# EAGLE design RN2483_2903_1ANT_RevA (EAGLE 7.2.0)
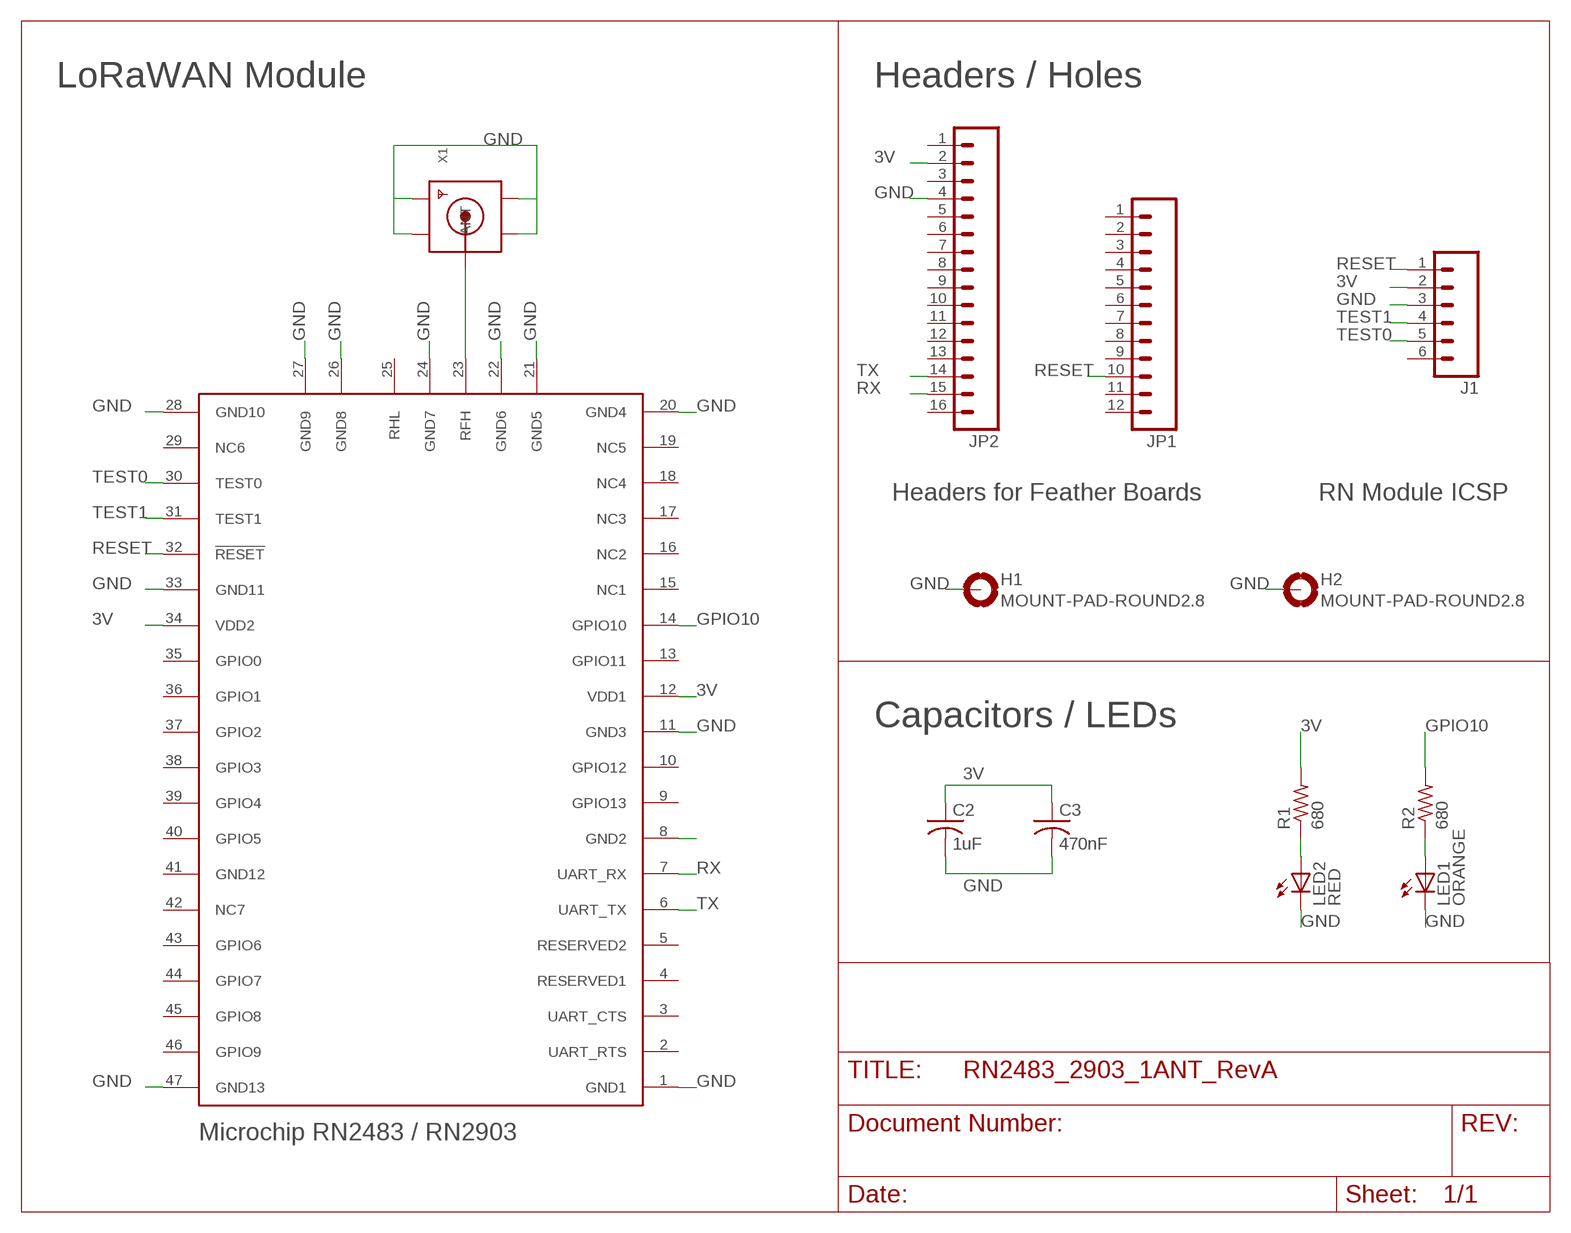
[diagram p0: schematic, sheet 1]

## Parts
C2  1uF  C-USC0603  [C0603]
C3  470nF  C-USC0603  [C0603]
H1  MOUNT-PAD-ROUND2.8  [2,8-PAD]
H2  MOUNT-PAD-ROUND2.8  [2,8-PAD]
J1  M06SILK_FEMALE_PTH  [1X06]
JP1  M12NO_SILK  [1X12_NO_SILK]
JP2  M161X16_NO_SILK  [1X16_NO_SILK]
LED1  ORANGE  LEDCHIPLED_0805  [CHIPLED_0805]
LED2  RED  LEDCHIPLED_0805  [CHIPLED_0805]
R1  680  R-US_R0603  [R0603]
R2  680  R-US_R0603  [R0603]
U$2  RN2483/2903  [RN2483/2903]
X1  SMACONNECTOR_EDGE  [SMA_EDGELAUNCH]

## Nets
3V: C2.1 C3.1 J1.2 JP2.2 R1.2 U$2.12(VDD1) U$2.34(VDD2)
GND: C2.2 C3.2 H1.B2,8(MOUNT) H2.B2,8(MOUNT) J1.3 JP2.4 LED1.C LED2.C U$2.1(GND1) U$2.11(GND3) U$2.20(GND4) U$2.21(GND5) U$2.22(GND6) U$2.24(GND7) U$2.26(GND8) U$2.27(GND9) U$2.28(GND10) U$2.33(GND11) U$2.47(GND13) X1.GND@1(GND4) X1.GND@2(GND3) X1.GND@3(GND2) X1.GND@4(GND1)
GPIO10: R2.2 U$2.14(GPIO10)
N$2: LED1.A R2.1
N$3: U$2.23(RFH) X1.P(ANT)
N$5: U$2.8(GND2)
N$9: LED2.A R1.1
RESET: J1.1 JP1.10 U$2.32(!RESET)
RX: JP2.15 U$2.7(UART_RX)
TEST0: J1.5 U$2.30(TEST0)
TEST1: J1.4 U$2.31(TEST1)
TX: JP2.14 U$2.6(UART_TX)
Unconnected: J1.6 JP1.1 JP1.2 JP1.3 JP1.4 JP1.5 JP1.6 JP1.7 JP1.8 JP1.9 JP1.11 JP1.12 JP2.1 JP2.3 JP2.5 JP2.6 JP2.7 JP2.8 JP2.9 JP2.10 JP2.11 JP2.12 JP2.13 JP2.16 U$2.2(UART_RTS) U$2.3(UART_CTS) U$2.4(RESERVED1) U$2.5(RESERVED2) U$2.9(GPIO13) U$2.10(GPIO12) U$2.13(GPIO11) U$2.15(NC1) U$2.16(NC2) U$2.17(NC3) U$2.18(NC4) U$2.19(NC5) U$2.25(RHL) U$2.29(NC6) U$2.35(GPIO0) U$2.36(GPIO1) U$2.37(GPIO2) U$2.38(GPIO3) U$2.39(GPIO4) U$2.40(GPIO5) U$2.41(GND12) U$2.42(NC7) U$2.43(GPIO6) U$2.44(GPIO7) U$2.45(GPIO8) U$2.46(GPIO9)

## Notes on the sheet
- LoRaWAN Module | Headers / Holes
- Headers for Feather Boards | RN Module ICSP
- Capacitors / LEDs
- Microchip RN2483 / RN2903

## Library data of the parts
C2 C3 = adafruit:C-US: CAPACITOR, American symbol
H1 H2 = holes:MOUNT-PAD-ROUND: MOUNTING PAD, round
J1 = SparkFun-ConnectorsNEW:M06: Header 6 Standard 6-pin 0.1" header. Use with straight break away headers (SKU : PRT-00116), right angle break away headers (PRT-00553), swiss pins (PRT-00743), machine pins (PRT-00117), and female headers (PRT-00115). Molex polarized connector foot print use with SKU : PRT-08094 with associated crimp pins and housings. NOTES ON THE VARIANTS LOCK and LOCK_LONGPADS... This footprint was designed to help hold the alignment of a through-hole component (i.e. 6-pin header) while soldering it into place. You may notice that each hole has been shifted either up or down by 0.005 of an inch from it's more standard position (which is a perfectly straight line). This slight alteration caused the pins (the squares in the middle) to touch the edges of the holes. Because they are alternating, it causes a "brace" to hold the component in place. 0.005 has proven to be the perfect amount of "off-center" position when using our standard breakaway headers. Although looks a little odd when you look at the bare footprint, once you have a header in there, the alteration is very hard to notice. Also,if you push a header all the way into place, it is covered up entirely on the bottom side. This idea of altering the position of holes to aid alignment will be further integrated into the Sparkfun Library for other footprints. It can help hold any component with 3 or more connection pins.; PROD_ID: CONN-08437
JP1 = SparkFun-Connectors:M12: Header 12 Standard 12-pin 0.1" header. Use with straight break away headers (SKU : PRT-00116), right angle break away headers (PRT-00553), swiss pins (PRT-00743), machine pins (PRT-00117), and female headers (PRT-00115).
JP2 = SparkFun-Connectors:M16: 1x16 .1" header
LED1 LED2 = adafruit:LED: LED OSRAM: - CHIPLED LG R971, LG N971, LY N971, LG Q971, LY Q971, LO R971, LY R971 LH N974, LH R974 LS Q976, LO Q976, LY Q976 LO Q996 - Hyper CHIPLED LW Q18S LB Q993, LB Q99A, LB R99A - SideLED LS A670, LO A670, LY A670, LG A670, LP A670 LB A673, LV A673, LT A673, LW A673 LH A674 LY A675 LS A676, LA A676, LO A676, LY A676, LW A676 LS A679, LY A679, LG A679 - Hyper Micro SIDELED® LS Y876, LA Y876, LO Y876, LY Y876 LT Y87S - SmartLED LW L88C, LW L88S LB L89C, LB L89S, LG L890 LS L89K, LO L89K, LY L89K LS L896, LA L896, LO L896, LY L896 - TOPLED LS T670, LO T670, LY T670, LG T670, LP T670 LSG T670, LSP T670, LSY T670, LOP T670, LYG T670 LG T671, LOG T671, LSG T671 LB T673, LV T673, LT T673, LW T673 LH T674 LS T676, LA T676, LO T676, LY T676, LB T676, LH T676, LSB T676, LW T676 LB T67C, LV T67C, LT T67C, LS T67K, LO T67K, LY T67K, LW E67C LS E67B, LA E67B, LO E67B, LY E67B, LB E67C, LV E67C, LT E67C LW T67C LS T679, LY T679, LG T679 LS T770, LO T770, LY T770, LG T770, LP T770 LB T773, LV T773, LT T773, LW T773 LH T774 LS E675, LA E675, LY E675, LS T675 LS T776, LA T776, LO T776, LY T776, LB T776 LHGB T686 LT T68C, LB T68C - Hyper Mini TOPLED® LB M676 - Mini TOPLED Santana® LG M470 LS M47K, LO M47K, LY M47K Source: http://www.osram.convergy.de/
R1 R2 = adafruit2:R-US_: RESISTOR, American symbol
U$2 = _CustomParts:RN2483/2903
X1 = adafruit:SMACONNECTOR: SMA Connector 90° DIP SMA Connector, 50 Ohm (4UConnector: 07259)

## Net classes
1 power: width 0.305 mm

## Board
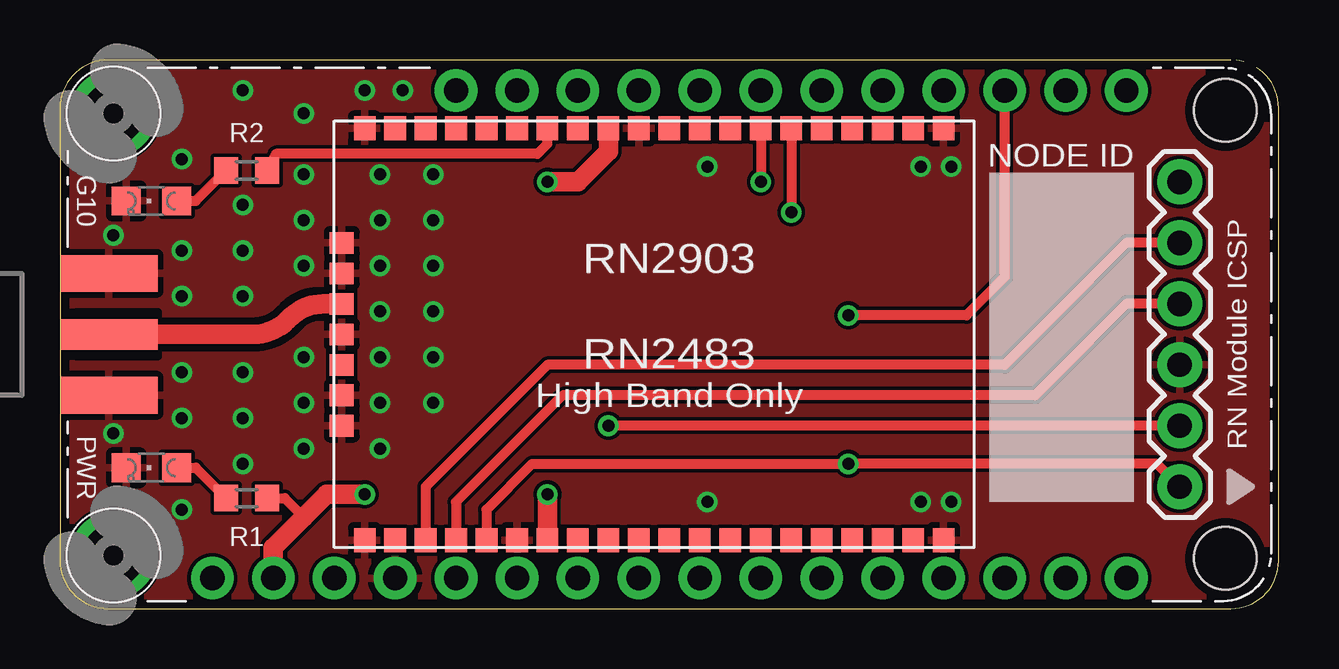
[diagram p1: board, top side]
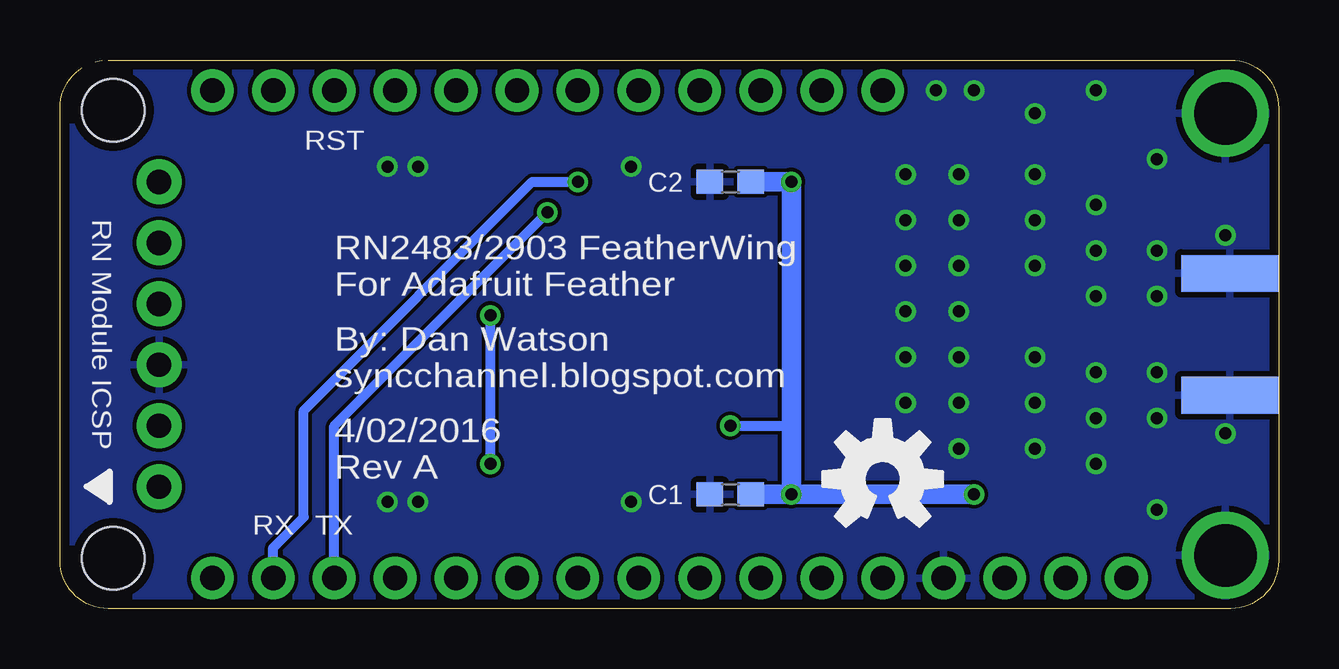
[diagram p2: board, bottom side, seen from below]

Size 50.8 x 22.86 mm. Coordinates in mm from the lower left corner, seen from the top.
Outline: 0,20.86 0,2 arc90 2,0 48.8,0 arc90 50.8,2 50.8,20.86 arc90 48.8,22.86 2,22.86 arc90 0,20.86
Copper layers (1*16): Top 0.0356mm / dielectric 1.5011mm / Bottom 0.0356mm
Design rules "oshpark-2layer *": minimum track width 6mil, minimum drill 13mil, track to track 6mil, track to pad 6mil, pad to pad 6mil, via to via 6mil, smd to smd 6mil, copper to edge 15mil, drill to drill 6mil, minimum pad ring 7mil, minimum via ring 7mil, stop-mask expansion 4mil, vias tented up to drill 20mil, thermal gap 10mil
Holes 2.6 mm at 48.58,20.76 48.58,2.1
tRestrict: area 0.6,10.5 to 4.1,12.4; 4 lines

### Footprints (pad centres in the part's own frame; a part is rotated, then mirrored left to right if it is on the bottom)
C0603 = smd 1.1 x 1: 1 -0.85,0; 2 0.85,0
2,8-PAD = drill 2.6 pad 3.6: B2,8 0,0
1X06 = drill 1.016 pad 1.88: 1 0,0; 2 2.54,0; 3 5.08,0; 4 7.62,0; 5 10.16,0; 6 12.7,0
1X12_NO_SILK = drill 1.016 pad 1.778: 1 0,0; 2 2.54,0; 3 5.08,0; 4 7.62,0; 5 10.16,0; 6 12.7,0; 7 15.24,0; 8 17.78,0; 9 20.32,0; 10 22.86,0; 11 25.4,0; 12 27.94,0
1X16_NO_SILK = drill 1.016 pad 1.778: 1 0,0; 2 2.54,0; 3 5.08,0; 4 7.62,0; 5 10.16,0; 6 12.7,0; 7 15.24,0; 8 17.78,0; 9 20.32,0; 10 22.86,0; 11 25.4,0; 12 27.94,0; 13 30.48,0; 14 33.02,0; 15 35.56,0; 16 38.1,0
CHIPLED_0805 = smd 1.2 x 1.2: A 0,-1.05; C 0,1.05
R0603 = smd 1 x 1.1: 1 -0.85,0; 2 0.85,0
RN2483/2903 = smd 1 x 0.9: 1 17.468,1.27; 2 17.468,2.54; 3 17.468,3.81; 4 17.468,5.08; 5 17.468,6.35; 6 17.468,7.62; 7 17.468,8.89; 8 17.468,10.16; 9 17.468,11.43; 10 17.468,12.7; 11 17.468,13.97; 12 17.468,15.24; 13 17.468,16.51; 14 17.468,17.78; 15 17.468,19.05; 16 17.468,20.32; 17 17.468,21.59; 18 17.468,22.86; 19 17.468,24.13; 20 17.468,25.4; 28 0.312,25.4; 29 0.312,24.13; 30 0.312,22.86; 31 0.312,21.59; 32 0.312,20.32; 33 0.312,19.05; 34 0.312,17.78; 35 0.312,16.51; 36 0.312,15.24; 37 0.312,13.97; 38 0.312,12.7; 39 0.312,11.43; 40 0.312,10.16; 41 0.312,8.89; 42 0.312,7.62; 43 0.312,6.35; 44 0.312,5.08; 45 0.312,3.81; 46 0.312,2.54; 47 0.312,1.27 | smd 0.9 x 1: 21 12.7,26.358; 22 11.43,26.358; 23 10.16,26.358; 24 8.89,26.358; 25 7.62,26.358; 26 6.35,26.358; 27 5.08,26.358
SMA_EDGELAUNCH = smd 4.064 x 1.524: GND@1 2.032,-2.54; GND@2 2.032,2.54 | smd 4.064 x 1.524 bottom: GND@3 2.032,2.54; GND@4 2.032,-2.54 | smd 4.064 x 1.27: P 2.032,0

### Placement (x,y rotation side)
C2  22.86,17.78 180 bottom
C3  22.86,4.76 180 bottom
H1  2.22,20.64 0 top
H2  2.22,2.22 0 top
J1  46.67,5.08 90 top
JP1  16.51,21.59 0 top
JP2  6.35,1.27 0 top
LED1  3.81,16.99 90 top
LED2  3.81,5.87 90 top
R1  7.78,4.6 0 top
R2  7.78,18.26 0 top
U$1  [OSHW-LOGO-M]  16.51,5.4 0 bottom
U$2  38.1,2.54 90 top
X1  0,11.43 0 top

### Tracks (layer width: path | path; a pad name or v marks a point on that pad's centre or on a via)
3V  (via drill 0.5)
  Top 0.406: J1.2 v22.86,7.62 | R1.2 9.37,4.6 10.16,3.81
  Top 0.813: U$2.34 v20.32,4.76 | v20.32,17.78 21.59,17.78 22.86,19.05 U$2.12 | v12.7,4.76 11.11,4.76 10.16,3.81 8.89,2.54 JP2.2
  Bottom 0.406: v22.86,7.62 20.32,7.62
  Bottom 0.813: v12.7,4.76 v20.32,4.76 | v20.32,4.76 20.32,7.62 v20.32,17.78 C2.1 | C3.1 v20.32,4.76
GND  (via drill 0.5)
  other vias: 5.08,13.02 7.62,13.02 7.62,14.92 5.08,14.92 10.16,14.29 10.16,10.48 7.62,9.84 7.62,7.94 5.08,9.84 5.08,7.94 10.16,8.57 2.22,15.56 2.22,7.3 5.08,4.13 13.34,16.19 13.34,14.29 13.34,10.48 13.34,8.57 15.56,16.19 15.56,14.29 15.56,10.48 15.56,8.57 13.34,6.67 12.7,21.59 15.56,18.1 13.34,18.1 10.16,16.19 10.16,18.1 7.62,16.83 10.16,20.64 5.08,18.73 7.62,6.03 10.16,6.67 13.34,12.38 15.56,12.38 7.62,21.59 37.15,18.41 35.88,18.41 35.88,4.45 37.15,4.45 26.99,18.41 26.99,4.45 14.29,21.59
  pour Top: -6.35,26.67 -6.35,-3.81 54.61,-3.81 54.61,26.67
  pour Bottom: -7.62,27.94 -7.62,-5.08 55.88,-5.08 55.88,29.21 -7.62,29.21
GPIO10
  Top 0.406: U$2.14 20.32,19.37 19.9,18.95 9,18.95 R2.2
N$2
  Top 0.406: LED1.A 5.66,16.99 R2.1
N$3
  Top 0.813: U$2.23 10.99,12.7 arc45 9.57,12.11 9.48,12.02 arc-45 8.06,11.43 X1.P
N$9
  Top 0.406: LED2.A 5.66,5.87 R1.1
RESET  (via drill 0.5)
  Top 0.406: U$2.32 17.78,4.13 19.68,6.03 v32.86,6.03 45.72,6.03 J1.1 | JP1.10 39.37,13.81 37.78,12.22 v32.86,12.22
  Bottom 0.406: v32.86,6.03 v32.86,12.22
RX  (via drill 0.5)
  Top 0.406: U$2.7 v29.21,17.78
  Bottom 0.406: JP2.15 41.91,2.54 40.64,3.81 40.64,8.26 31.11,17.78 v29.21,17.78
TEST0
  Top 0.406: J1.5 44.45,15.24 39.37,10.16 20.32,10.16 15.24,5.08 U$2.30
TEST1
  Top 0.406: J1.4 44.45,12.7 40.64,8.89 20.95,8.89 16.51,4.45 U$2.31
TX  (via drill 0.5)
  Top 0.406: U$2.6 v30.48,16.51
  Bottom 0.406: JP2.14 39.37,7.62 v30.48,16.51

### Text on the board
tNames: R2 | NODE ID | G10 | RN2903 | RN2483 | RN Module ICSP | High Band Only | PWR | R1
bNames: RST | C2 | RN2483/2903 FeatherWing / For Adafruit Feather | RN Module ICSP | By: Dan Watson / syncchannel.blogspot.com | 4/02/2016 / Rev A | C1 | TX | RX